# Altium schematic sheet Sheet_1_2024-11-04.schdoc
size 668 x 429 mm
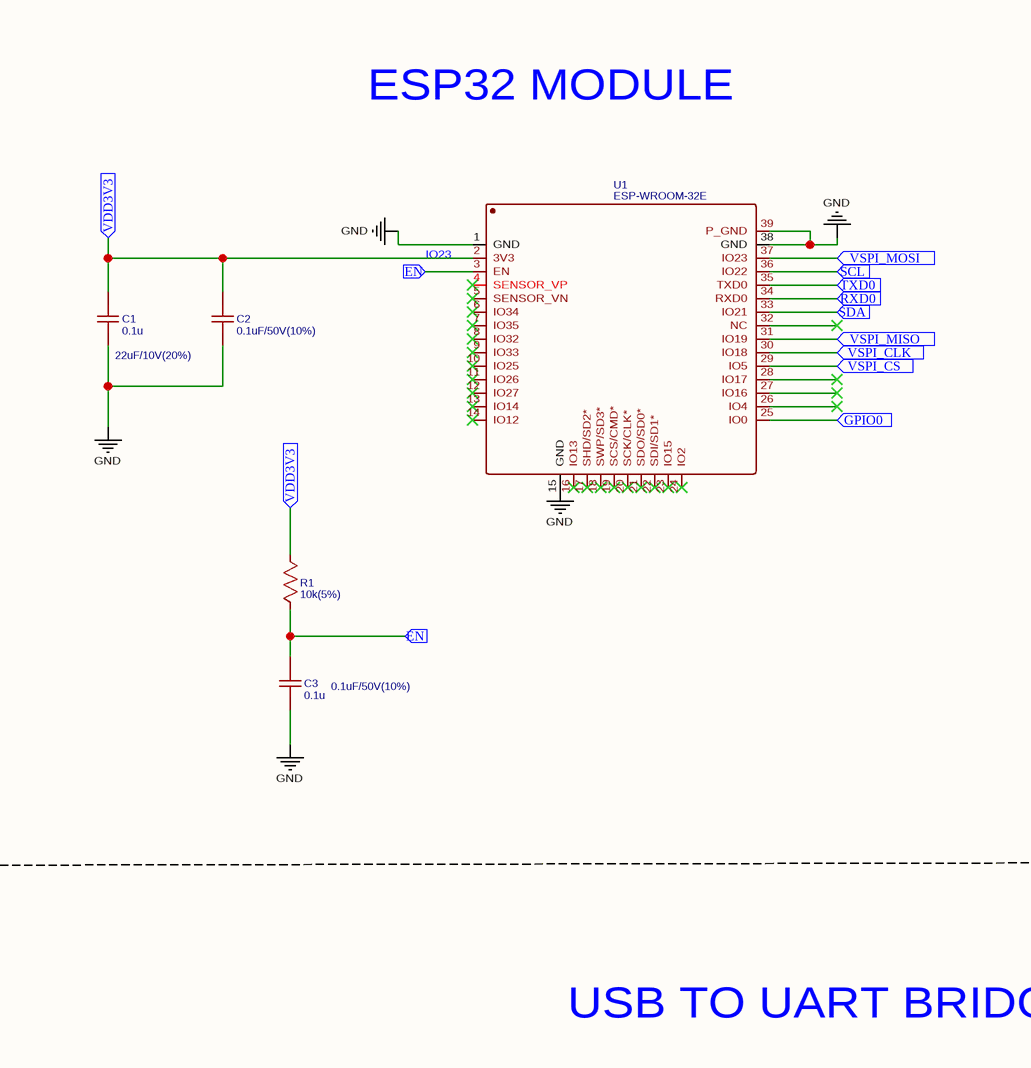
[diagram p0: Sheet_1_2024-11-04.schdoc, top left]
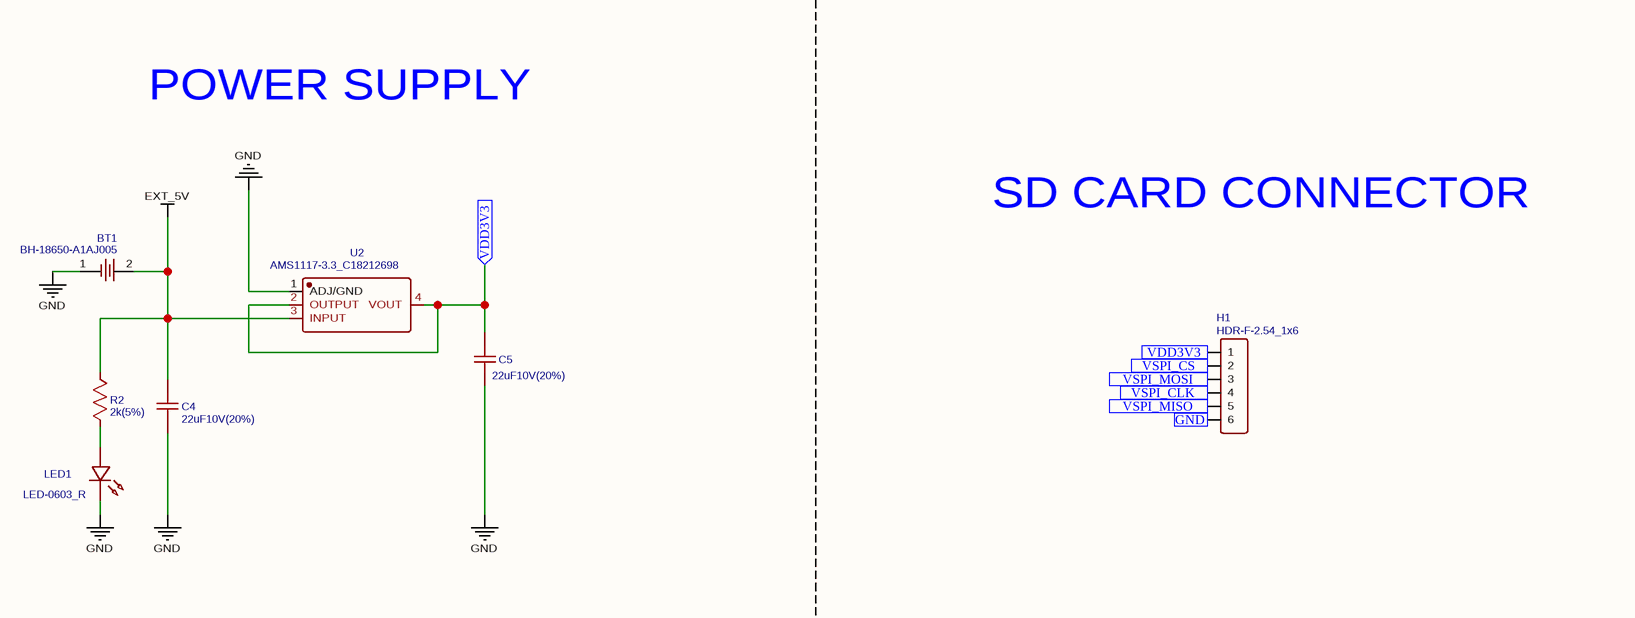
[diagram p1: Sheet_1_2024-11-04.schdoc, top right]
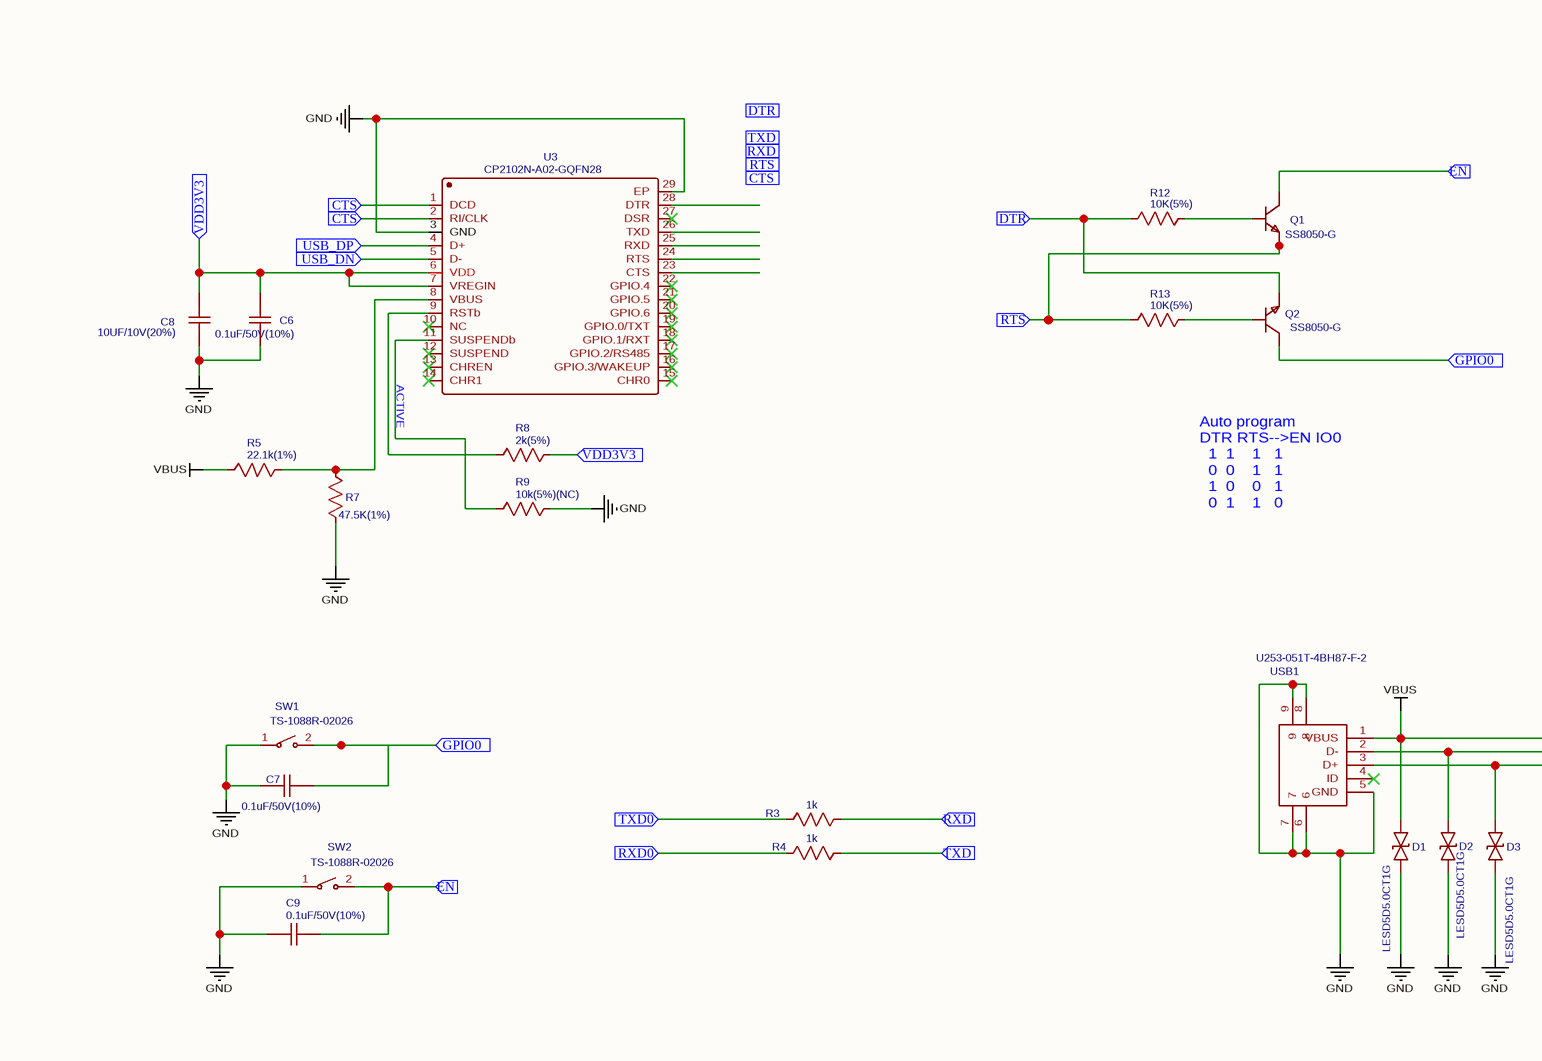
[diagram p2: Sheet_1_2024-11-04.schdoc, bottom left]
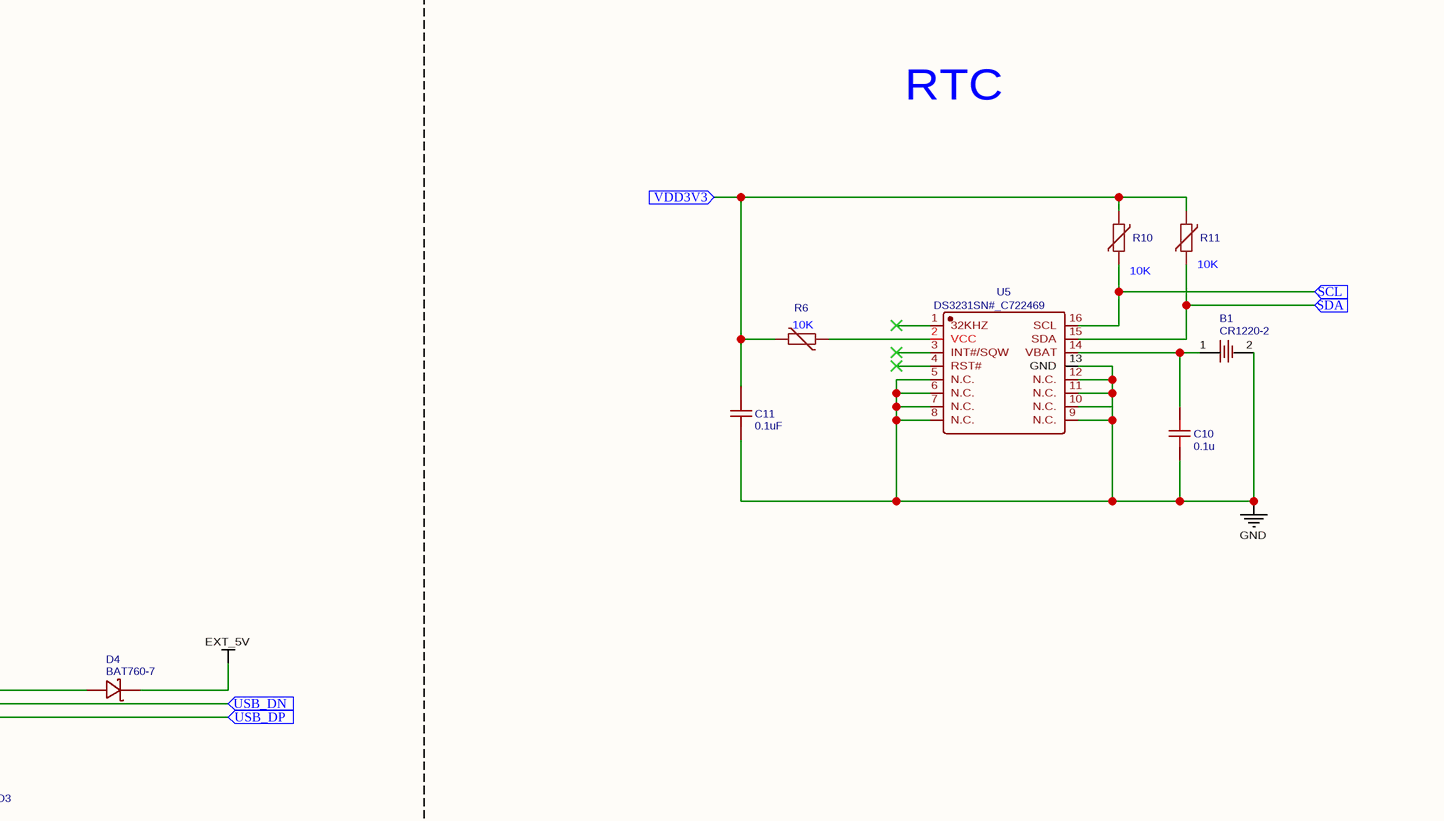
[diagram p3: Sheet_1_2024-11-04.schdoc, bottom right]

## Parts
B1  CR1220-2  [BAT-SMD_CR1220-2]
BT1  BH-18650-A1AJ005  [BAT-TH_BH-18650-A1AJ005]
C1  0.1u  [C0603]
C2  0.1uF/50V(10%)  [C0603]
C3  0.1u  [C0603]
C4  22uF10V(20%)  [C0603]
C5  0.1u  [C0603]  (value not drawn)
C6  0.1uF/50V(10%)  [C0603]
C7  0.1uF/50V(10%)  [C0603]
C8  10UF/10V(20%)  [C0603]
C9  0.1uF/50V(10%)  [C0603]
C10  0.1u  [C0603]
C11  0.1uF  [C0603]
D1  LESD5D5.0CT1G  [SOD-523_L1.2-W0.8-LS1.6-BI]
D2  LESD5D5.0CT1G  [SOD-523_L1.2-W0.8-LS1.6-BI]
D3  LESD5D5.0CT1G  [SOD-523_L1.2-W0.8-LS1.6-BI]
D4  BAT760-7  [SOD-323_L1.8-W1.3-LS2.5-RD]
H1  HDR-F-2.54_1x6  [HDR-F-2.54_1X6]
LED1  LED-0603_R  [LED0603_RED]
Q1  SS8050-G  [SOT-23-3_L2.9-W1.3-P1.90-LS2.4-BR]
Q2  SS8050-G  [SOT-23-3_L2.9-W1.3-P1.90-LS2.4-BR]
R1  10k(5%)  [R0603]
R2  2k(5%)  [R0603]
R3  1k  [R0603]
R4  1k  [R0603]
R5  22.1k(1%)  [R0603]
R6  VARISTOR-5  [R-5]  (value not drawn)
R7  47.5K(1%)  [R0603]
R8  2k(5%)  [R0603]
R9  10k(5%)(NC)  [R0603]
R10  VARISTOR-5  [R-5]  (value not drawn)
R11  VARISTOR-5  [R-5]  (value not drawn)
R12  10K(5%)  [R0603]
R13  10K(5%)  [R0603]
SW1  TS-1088R-02026  [SW-SMD_L3.9-W3.0-P4.45]
SW2  TS-1088R-02026  [SW-SMD_L3.9-W3.0-P4.45]
U1  ESP-WROOM-32E  [COMM-SMD_ESP-WROOM-32D]
U2  AMS1117-3.3_C18212698  [SOT-223-3_L6.5-W3.4-P2.30-LS7.0-BR]
U3  CP2102N-A02-GQFN28  [QFN-28_L5.0-W5.0-P0.50-TL-EP3.3]
U5  DS3231SN#_C722469  [SOIC-16_L10.3-W7.5-P1.27-LS10.3-BL]
USB1  U253-051T-4BH87-F-2  [MICRO-USB-SMD_U253-051T-4BH87-S-2]

## Ports
CTS (in), DTR (in), EN (in), GND (in), GPIO0 (in), RTS (in), RXD0 (in), RXD (in), SCL (in), SDA (in), TXD0 (in), TXD (in), USB_DN (in), USB_DP (in), VDD3V3 (in), VSPI_CLK (in), VSPI_CS (in), VSPI_MISO (in), VSPI_MOSI (in)

## Nets
EXT_5V: BT1.2 C4.2 D4.1 R2.2 U2.3(INPUT)
GND: B1.2 BT1.1 C1.1 C2.1 C3.1 C4.1 C5.1 C6.2 C7.1 C8.2 C9.1 C10.2 C11.1 D1.1 D2.1 D3.1 LED1.2 R7.1 R9.2 SW1.1 SW2.1 U1.1(GND) U1.15(GND) U1.38(GND) U1.39(P_GND) U2.1(ADJ/GND) U3.3(GND) U3.29(EP) U5.5(N.C.) U5.6(N.C.) U5.7(N.C.) U5.8(N.C.) U5.9(N.C.) U5.10(N.C.) U5.11(N.C.) U5.12(N.C.) U5.13(GND) USB1.5(GND) USB1.6 USB1.7 USB1.8 USB1.9
VBUS: D1.2 D4.2 R5.1 USB1.1(VBUS)
CTS: U3.1(DCD) U3.2(RI/CLK) ; port CTS
DTR: Q2.2(E) R12.1 ; port DTR
EN: C3.2 C9.2 Q1.3(C) R1.1 SW2.2 U1.3(EN) ; port EN
GND: H1.6 ; port GND  [a separate net that carries the same name]
GPIO0: C7.2 Q2.3(C) SW1.2 U1.25(IO0) ; port GPIO0
RTS: Q1.2(E) R13.1 ; port RTS
RXD: R3.2 ; port RXD
RXD0: R4.1 U1.34(RXD0) ; port RXD0
SCL: R10.2 U1.36(IO22) U5.16(SCL) ; port SCL
SDA: R11.2 U1.33(IO21) U5.15(SDA) ; port SDA
TXD: R4.2 ; port TXD
TXD0: R3.1 U1.35(TXD0) ; port TXD0
USB_DN: D2.2 U3.5(D-) USB1.2(D-) ; port USB_DN
USB_DP: D3.2 U3.4(D+) USB1.3(D+) ; port USB_DP
VDD3V3: C1.2 C2.2 C5.2 C6.1 C8.1 C11.2 H1.1 R1.2 R6.2 R8.2 R10.1 R11.1 U1.2(3V3) U2.2(OUTPUT) U2.4(VOUT) U3.6(VDD) U3.7(VREGIN) ; port VDD3V3
VSPI_CLK: H1.4 U1.30(IO18) ; port VSPI_CLK
VSPI_CS: H1.2 U1.29(IO5) ; port VSPI_CS
VSPI_MISO: H1.5 U1.31(IO19) ; port VSPI_MISO
VSPI_MOSI: H1.3 U1.37(IO23) ; port VSPI_MOSI
NetB1_1: B1.1 C10.1 U5.14(VBAT)
NetLED1_1: LED1.1 R2.1
NetQ1_1: Q1.1(B) R12.2
NetQ2_1: Q2.1(B) R13.2
NetR5_2: R5.2 R7.2 U3.8(VBUS)
NetR6_1: R6.1 U5.2(VCC)
NetR8_1: R8.1 U3.9(RSTb)
NetR9_1: R9.1 U3.11(SUSPENDb)

Not connected (* = marked no-connect by the designer): U1 4(SENSOR_VP)* 5(SENSOR_VN)* 6(IO34)* 7(IO35)* 8(IO32)* 9(IO33)* 10(IO25)* 11(IO26)* 12(IO27)* 13(IO14)* 14(IO12)* 16(IO13)* 17(SHD/SD2*)* 18(SWP/SD3*)* 19(SCS/CMD*)* 20(SCK/CLK*)* 21(SDO/SD0*)* 22(SDI/SD1*)* 23(IO15)* 24(IO2)* 26(IO4)* 27(IO16)* 28(IO17)* 32(NC)*; U3 10(NC)* 12(SUSPEND)* 13(CHREN)* 14(CHR1)* 15(CHR0)* 16(GPIO.3/WAKEUP)* 17(GPIO.2/RS485)* 18(GPIO.1/RXT)* 19(GPIO.0/TXT)* 20(GPIO.6)* 21(GPIO.5)* 22(GPIO.4)* 23(CTS) 24(RTS) 25(RXD) 26(TXD) 27(DSR)* 28(DTR); U5 1(32KHZ)* 3(INT#/SQW)* 4(RST#)*; USB1 4(ID)*

## Notes on the sheet
- ESP32 MODULE
- POWER SUPPLY
- SD CARD CONNECTOR
- (near U1) IO23
- (near C1) 22uF/10V(20%)
- (near C5) 22uF10V(20%)
- (near C3) 0.1uF/50V(10%)
- USB TO UART BRIDGE
- RTC
- 10K
- (near R11) 10K
- (near U3) ACTIVE
- Auto program
  DTR RTS-->EN IO0
  1  1    1   1
  0  0    1   1
  1  0    0   1
  0  1    1   0
- (near R6) 10K

## Library data of the parts
B1 = CR1220-2: Manufacturer: Q&J; Supplier: LCSC; Manufacturer Part: CR1220-2; Supplier Part: C70381; JLCPCB Part Class: Extended Part; spicePre: B; spiceSymbolName: CR1220-2
BT1 = BH-18650-A1AJ005: Manufacturer: MYOUNG(美阳); Contributor: lcsc; Supplier: LCSC; Supplier Part: C5290176; Manufacturer Part: BH-18650-A1AJ005; JLCPCB Part Class: Extended Part; spicePre: B; spiceSymbolName: BH-18650-A1AJ005
C1 C3 C5 C10 = 0.1u: nameAlias: Value(F); Contributor: LCEDA_Lib; spicePre: C; spiceSymbolName: C_0603_US
C2 C6 C7 C9 = 0.1uF/50V(10%): nameAlias: Value(F); Contributor: LCEDA_Lib; spicePre: C; spiceSymbolName: C_0603_US
C4 = 22uF10V(20%): nameAlias: Value(F); Contributor: LCEDA_Lib; spicePre: C; spiceSymbolName: C_0603_US
C8 = 10UF/10V(20%): nameAlias: Value(F); Contributor: LCEDA_Lib; spicePre: C; spiceSymbolName: C_0603_US
C11 = 0.1uF: nameAlias: Value(F); Contributor: LCEDA_Lib; spicePre: C; spiceSymbolName: C_0603_US
D1-D3 = LESD5D5.0CT1G: Manufacturer: LRC(乐山无线电); Contributor: LCSC; Supplier: LCSC; Supplier Part: C383211; Manufacturer Part: LESD5D5.0CT1G; JLCPCB Part Class: Extended Part; spicePre: D; spiceSymbolName: LESD5D5.0CT1G
D4 = BAT760-7: Manufacturer: DIODES(美台); Contributor: LCSC; Supplier: LCSC; Manufacturer Part: BAT760-7; Supplier Part: C124187; JLCPCB Part Class: Extended Part; spicePre: D; spiceSymbolName: BAT760-7
H1 = HDR-F-2.54_1x6: Contributor: LCEDA_Lib; Supplier Part: C40877; Supplier: LCSC; spicePre: H; spiceSymbolName: HDR-F-2.54_1x6
LED1 = LED-0603_R: Manufacturer: EVERLIGHT(台湾亿光); Manufacturer Part: 19-217/R6C-AL1M2VY/3T; Contributor: LCEDA_01; Supplier Part: C72044; Supplier: LCSC; spicePre: L; spiceSymbolName: LED-0603_R
Q1 Q2 = SS8050-G: Manufacturer: CJ(江苏长电/长晶); Contributor: LCSC; Supplier: LCSC; Manufacturer Part: SS8050-G; Supplier Part: C164886; JLCPCB Part Class: Extended Part; spicePre: Q; spiceSymbolName: SS8050-G
R1 = 10k(5%): nameAlias: Value(Ω); Contributor: LCEDA_Lib; spicePre: R; spiceSymbolName: R_0603_US
R2 R8 = 2k(5%): nameAlias: Value(Ω); Contributor: LCEDA_Lib; spicePre: R; spiceSymbolName: R_0603_US
R3 R4 = 1k: nameAlias: Value(Ω); Contributor: LCEDA_Lib; spicePre: R; spiceSymbolName: R_0603_US
R5 = 22.1k(1%): nameAlias: Value(Ω); Contributor: LCEDA_Lib; spicePre: R; spiceSymbolName: R_0603_US
R6 R10 R11 = VARISTOR-5: Contributor: Pinoccio; description: VARISTOR; spicePre: R; spiceSymbolName: VARISTOR-5
R7 = 47.5K(1%): nameAlias: Value(Ω); Contributor: LCEDA_Lib; spicePre: R; spiceSymbolName: R_0603_US
R9 = 10k(5%)(NC): nameAlias: Value(Ω); Contributor: LCEDA_Lib; spicePre: R; spiceSymbolName: R_0603_US
R12 R13 = 10K(5%): nameAlias: Value(Ω); Contributor: LCEDA_Lib; spicePre: R; spiceSymbolName: R_0603_US
SW1 SW2 = TS-1088R-02026: Manufacturer: XUNPU(讯普); Contributor: LCSC; Supplier: LCSC; Supplier Part: C455280; Manufacturer Part: TS-1088R-02026; JLCPCB Part Class: Extended Part; spicePre: S; spiceSymbolName: TS-1088R-02026
U1 = ESP-WROOM-32E: Manufacturer: DOIT(四博智联); Contributor: lcsc; Supplier: LCSC; Supplier Part: C19949066; Manufacturer Part: ESP-WROOM-32E; JLCPCB Part Class: Extended Part; spicePre: U; spiceSymbolName: ESP-WROOM-32E
U2 = AMS1117-3.3_C18212698: Manufacturer: TECH PUBLIC(台舟); Contributor: lcsc; Supplier: LCSC; Supplier Part: C18212698; Manufacturer Part: AMS1117-3.3; spicePre: U; spiceSymbolName: AMS1117-3.3_C18212698
U3 = CP2102N-A02-GQFN28: Manufacturer: SKYWORKS/SILICON LABS(芯科); Contributor: LCSC; Supplier: LCSC; Supplier Part: C1550553; Manufacturer Part: CP2102N-A02-GQFN28; JLCPCB Part Class: Extended Part; spicePre: U; spiceSymbolName: CP2102N-A02-GQFN28
U5 = DS3231SN#_C722469: Manufacturer: ADI(亚德诺)/MAXIM(美信); Contributor: lcsc; Supplier: LCSC; Supplier Part: C722469; Manufacturer Part: DS3231SN#; JLCPCB Part Class: Extended Part; spicePre: U; spiceSymbolName: DS3231SN#_C722469
USB1 = U253-051T-4BH87-F-2: Manufacturer: XKB Connectivity(中国星坤); Manufacturer Part: U253-051T-4BH87-S2; Contributor: LCSC; Supplier: LCSC; Supplier Part: C319174; JLCPCB Part Class: Extended Part; spicePre: U; spiceSymbolName: U253-051T-4BH87-F-2